# Altium schematic sheet SCH_A2_Template.SchDoc
size A2
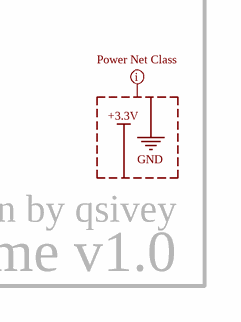
[diagram p0: SCH_A2_Template.SchDoc, bottom right]

## Layout directives
net class Power: +3.3V, GND

## Notes on the sheet
- Original design by qsivey
- ProjectName v1.0